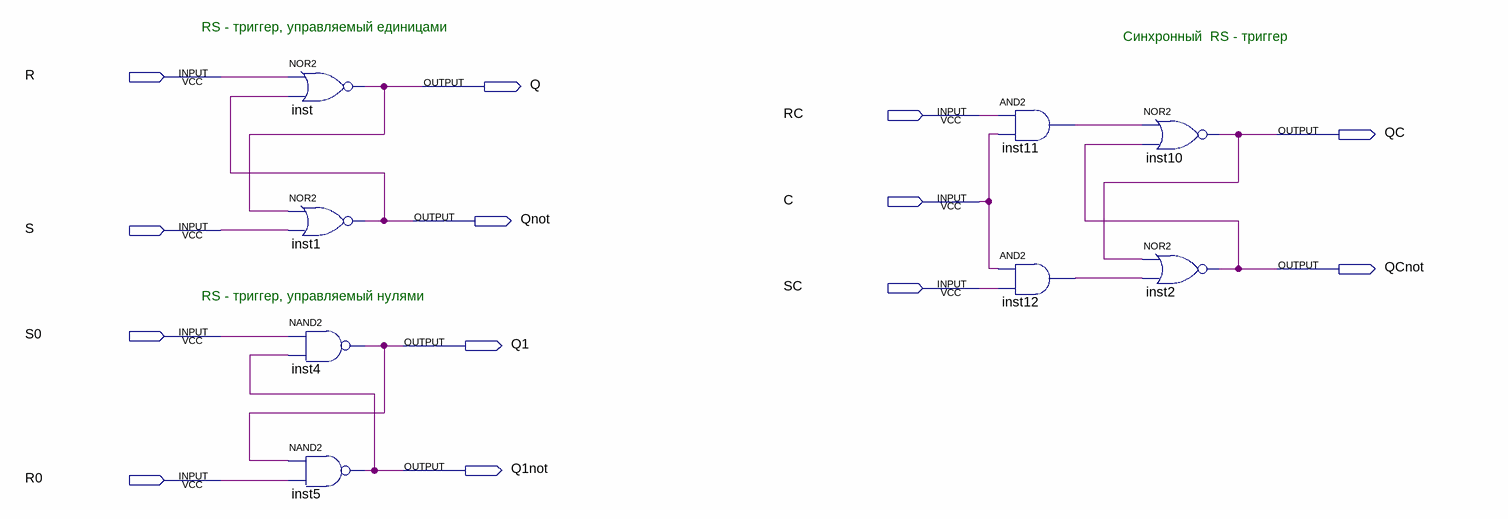
[diagram p0: schematic sheet]
// Quartus schematic RS-trigger.bdf as structural Verilog: 8 symbols, 13 pins
module \RS-trigger  (
  input  R,
  input  RC,
  input  C,
  input  S,
  input  SC,
  input  S0,
  input  R0,
  output Q,
  output QC,
  output Qnot,
  output QCnot,
  output Q1,
  output Q1not
);

  wire inst11_out, inst12_out;

  nor inst (Q, R, Qnot);
  nor inst1 (Qnot, Q, S);
  nand inst4 (Q1, S0, Q1not);
  nand inst5 (Q1not, Q1, R0);
  and inst11 (inst11_out, RC, C);
  and inst12 (inst12_out, C, SC);
  nor inst10 (QC, inst11_out, QCnot);
  nor inst2 (QCnot, QC, inst12_out);

  // Notes on the sheet:
  //   RS - триггер, управляемый единицами
  //   Синхронный  RS - триггер
  //   RS - триггер, управляемый нулями
endmodule
